# EAGLE design FatButtons (EAGLE 7.2.0)
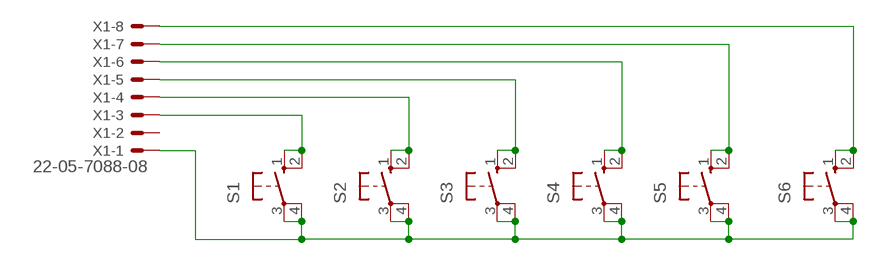
[diagram p0: schematic, sheet 1]

## Parts
S1  10-XX  [B3F-10XX]
S2  10-XX  [B3F-10XX]
S3  10-XX  [B3F-10XX]
S4  10-XX  [B3F-10XX]
S5  10-XX  [B3F-10XX]
S6  10-XX  [B3F-10XX]
X1  22-05-7088-08  [7395-08]

## Nets
N$1: S1.3(P) S1.4(P1) S2.3(P) S2.4(P1) S3.3(P) S3.4(P1) S4.3(P) S4.4(P1) S5.3(P) S5.4(P1) S6.3(P) S6.4(P1) X1.1
N$2: S1.1(S) S1.2(S1) X1.3
N$3: S2.1(S) S2.2(S1) X1.4
N$4: S3.1(S) S3.2(S1) X1.5
N$5: S4.1(S) S4.2(S1) X1.6
N$6: S5.1(S) S5.2(S1) X1.7
N$7: S6.1(S) S6.2(S1) X1.8
Unconnected: X1.2

## Library data of the parts
S1-S6 = switch-omron:10-XX: OMRON SWITCH; MPN: B3F-1000; OC_FARNELL: 176432; OC_NEWARK: 36M3542
X1 = con-molex:22-?-08: CONNECTOR wire to board 2.54 mm (.1 inch) pitch header; OC_FARNELL: unknown; OC_NEWARK: unknown

## Board
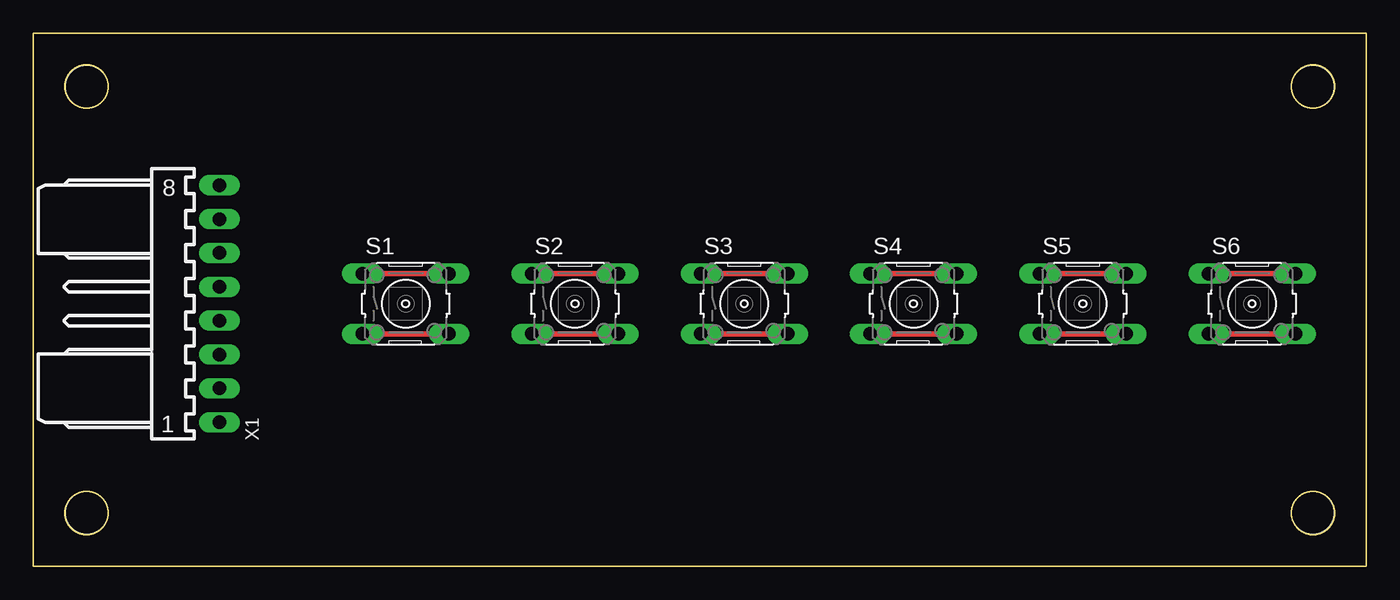
[diagram p1: board, top side]
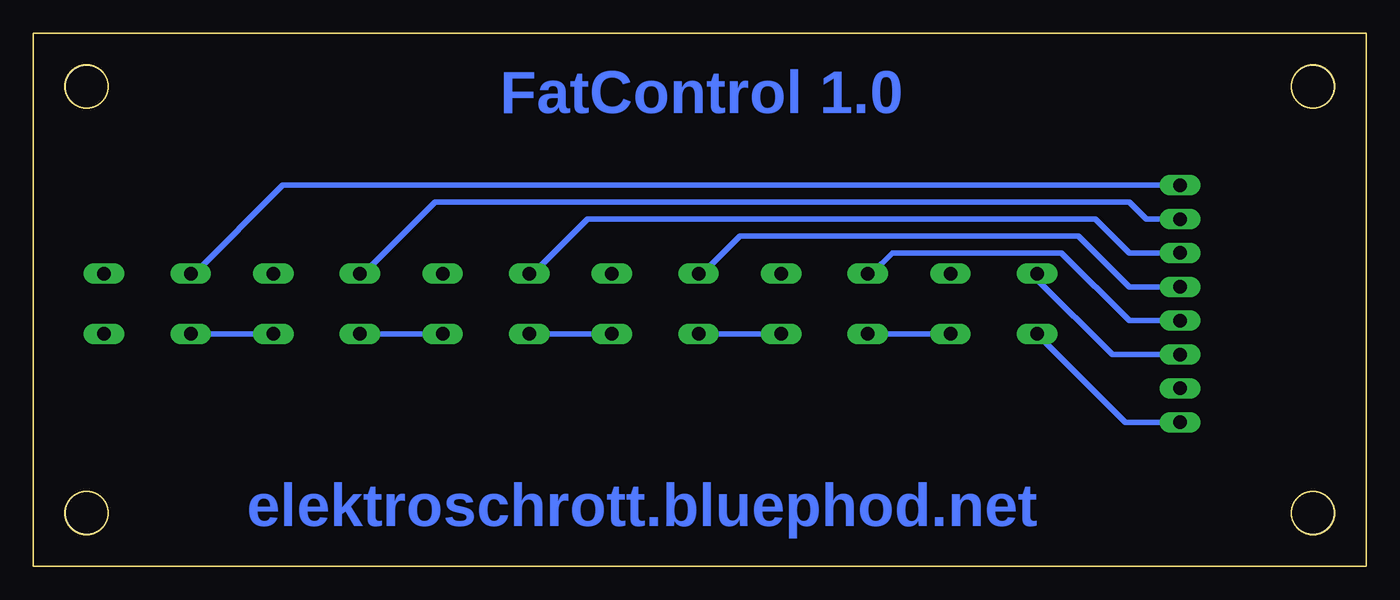
[diagram p2: board, bottom side, seen from below]

Size 100 x 40 mm. Coordinates in mm from the lower left corner, seen from the top.
Outline: 0,0 100,0 100,40 0,40 0,0
Outline: circle at 4,36 radius 1.6
Outline: circle at 4,4 radius 1.6
Outline: circle at 96,36 radius 1.6
Outline: circle at 96,4 radius 1.6
Outline: circle at 4,36 radius 1.6
Copper layers (1*16): Top 0.035mm / dielectric 1.5mm / Bottom 0.035mm
Design rules "default": minimum track width 10mil, minimum drill 24mil, track to track 8mil, track to pad 8mil, pad to pad 8mil, via to via 8mil, smd to smd 8mil, copper to edge 40mil, drill to drill 8mil, minimum pad ring 10mil, minimum via ring 8mil, stop-mask expansion 4mil, vias tented up to drill 0mil, thermal gap 10mil
Holes 3.2 mm at 4,4 4,36 96,36 96,4

### Footprints (pad centres in the part's own frame; a part is rotated, then mirrored left to right if it is on the bottom)
B3F-10XX = drill 1.016 long: 1 -3.251,2.261; 2 3.251,2.261; 3 -3.251,-2.261; 4 3.251,-2.261
7395-08 = drill 1.016 long: 1 8.89,0; 2 6.35,0; 3 3.81,0; 4 1.27,0; 5 -1.27,0; 6 -3.81,0; 7 -6.35,0; 8 -8.89,0

### Placement (x,y rotation side)
S1  27.94,19.7 0 top
S2  40.64,19.7 0 top
S3  53.34,19.7 0 top
S4  66.04,19.7 0 top
S5  78.74,19.7 0 top
S6  91.44,19.7 0 top
X1  13.97,19.7 270 top

### Tracks (layer width: path | path; a pad name or v marks a point on that pad's centre or on a via)
N$1
  Top 0.406: S1.3 S1.4 | S2.3 S2.4 | S4.3 S4.4 | S5.3 S5.4 | S6.3 S6.4 | S3.3 S3.4
  Bottom 0.406: S6.3 S5.4 | S5.3 S4.4 | S4.3 S3.4 | S3.3 S2.4 | S2.3 S1.4 | X1.1 18.06,10.81 S1.3
N$2
  Top 0.406: S1.1 S1.2
  Bottom 0.406: S1.1 24.69,21.53 19.05,15.89 X1.3
N$3
  Top 0.406: S2.1 S2.2
  Bottom 0.406: S2.1 37.11,21.96 35.56,23.51 22.86,23.51 17.78,18.43 X1.4
N$4
  Top 0.406: S3.2 S3.1
  Bottom 0.406: S3.1 49.81,21.96 46.99,24.78 21.59,24.78 17.78,20.97 X1.5
N$5
  Top 0.406: S4.1 S4.2
  Bottom 0.406: S4.1 62.51,21.96 58.42,26.05 20.32,26.05 17.78,23.51 X1.6
N$6
  Top 0.406: S5.1 S5.2
  Bottom 0.406: S5.1 75.21,21.96 69.85,27.32 17.78,27.32 16.51,26.05 X1.7
N$7
  Top 0.406: S6.1 S6.2
  Bottom 0.406: S6.1 87.91,21.96 81.28,28.59 X1.8

### Text on the board
Bottom: FatControl 1.0 | elektroschrott.bluephod.net